# EAGLE design Adafruit 96x64 RGB OLED Breakout (EAGLE 9.6.2)
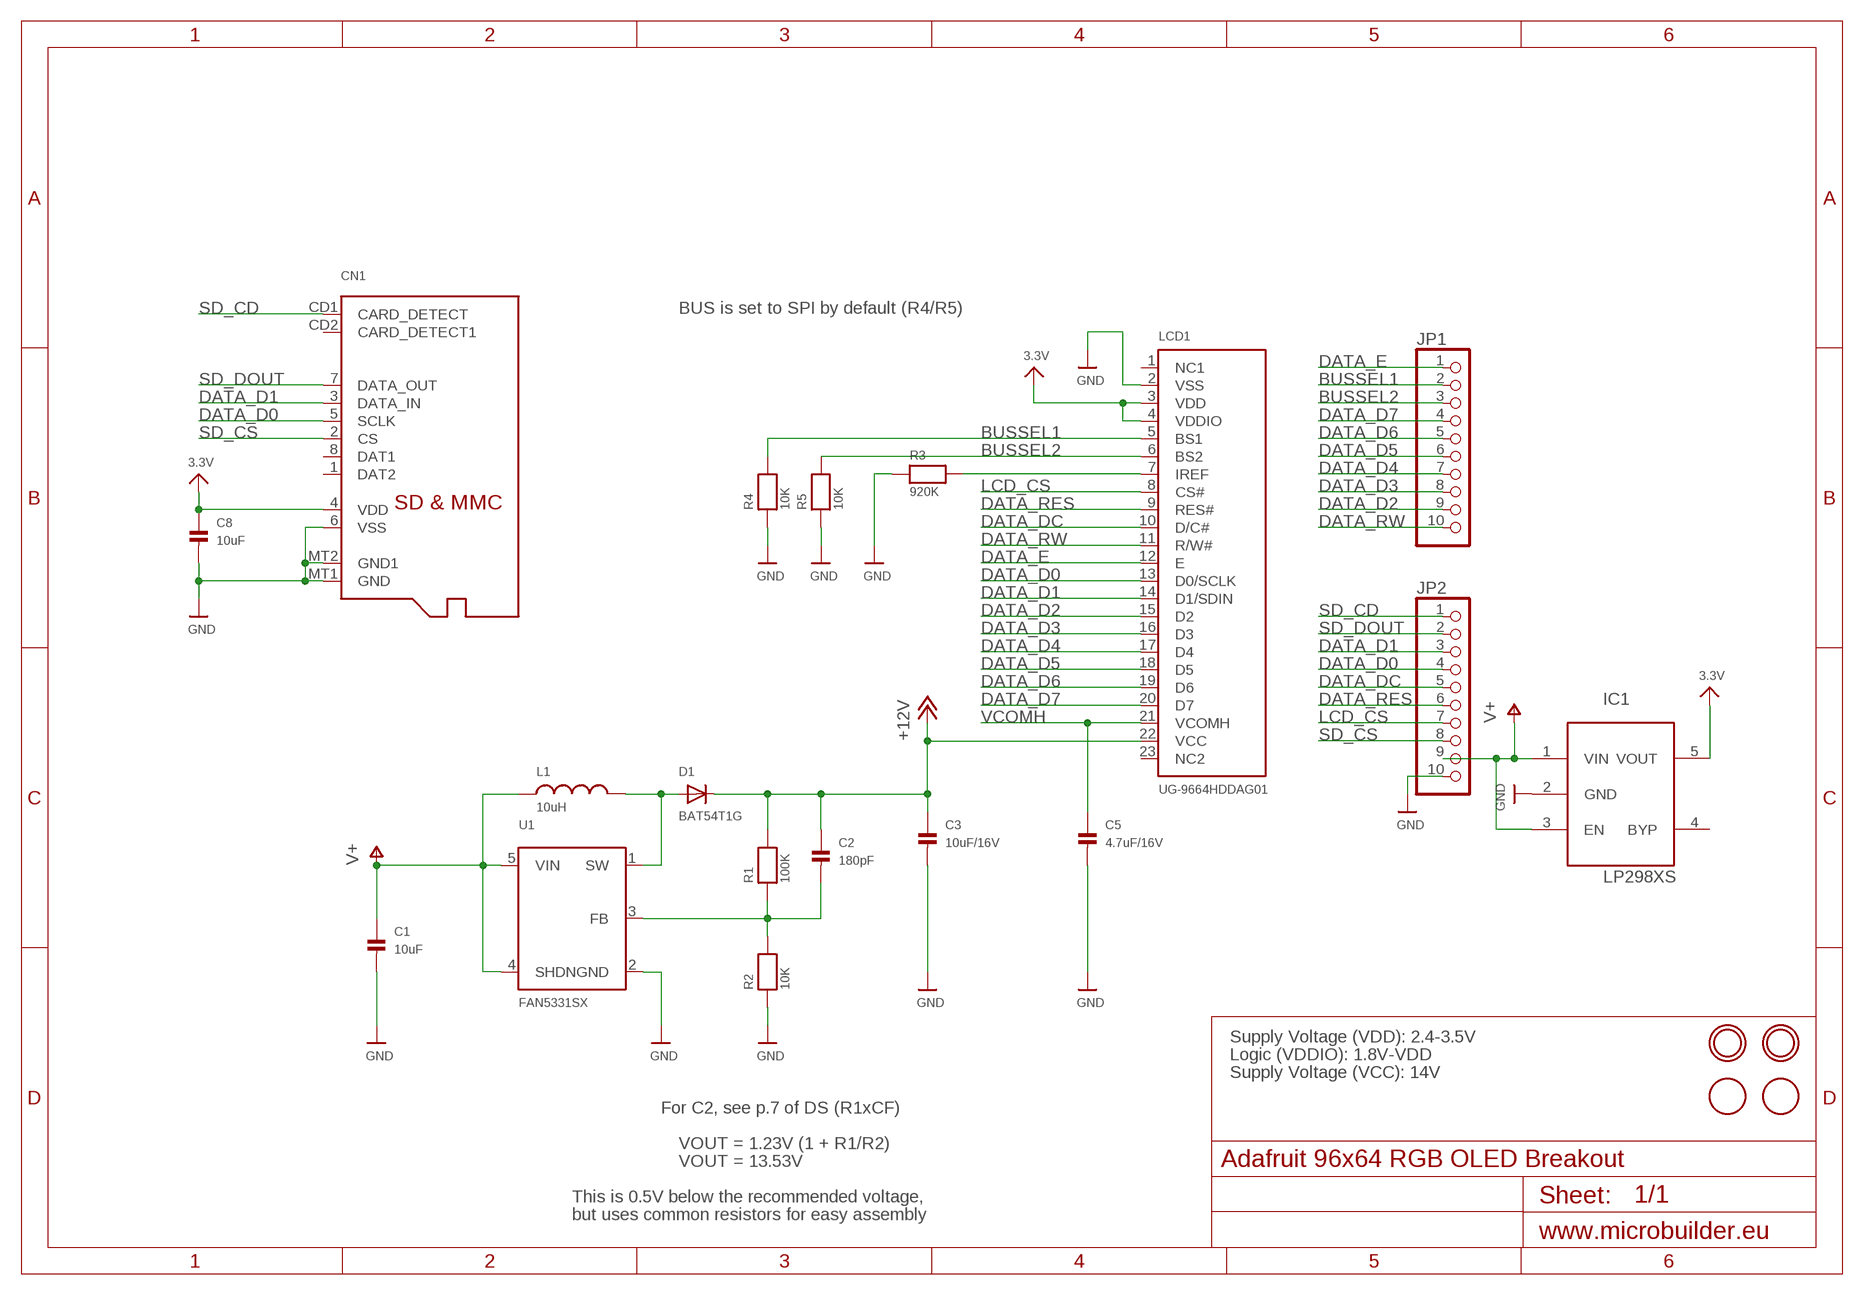
[diagram p0: schematic, sheet 1]

## Parts
C1  10uF  CAP_CERAMIC0805  [0805]
C2  180pF  CAP_CERAMIC0805  [0805]
C3  10uF/16V  CAP_CERAMIC0805  [0805]
C5  4.7uF/16V  CAP_CERAMIC0805  [0805]
C8  10uF  CAP_CERAMIC0805  [0805]
CN1  MICROSD  [MICROSD]
D1  BAT54T1G  DIODESOD-123  [SOD-123]
IC1  LP298XS  [SOT23-5L]
JP1  HEADER-1X10THICKER  [1X10_ROUND_76]
JP2  HEADER-1X10THICKER  [1X10_ROUND_76]
L1  10uH  INDUCTOR  [INDUCTOR_1007]
LCD1  UG-9664HDDAG01  OLED_UG-9664HDDAG01WRAPAROUND  [UG-9664HDDAG01_WRAPAROUND]
R1  100K  RESISTOR0805  [0805]
R2  10K  RESISTOR0805  [0805]
R3  920K  RESISTOR0805  [0805]
R4  10K  RESISTOR0805  [0805]
R5  10K  RESISTOR0805  [0805]
U1  FAN5331SX  FAN5331  [SOT23-5]
U$9  MOUNTINGHOLE2.0  [MOUNTINGHOLE_2.0_PLATED]
U$11  MOUNTINGHOLE2.0  [MOUNTINGHOLE_2.0_PLATED]
U$12  FIDUCIAL  [FIDUCIAL_1MM]
U$13  FIDUCIAL  [FIDUCIAL_1MM]

## Nets
3.3V: C8.1 CN1.4(VDD) IC1.5(VOUT) LCD1.3(VDD) LCD1.4(VDDIO)
+12V: C2.1 C3.1 D1.C LCD1.22(VCC) R1.2
BUSSEL1: JP1.2 LCD1.5(BS1) R4.2
BUSSEL2: JP1.3 LCD1.6(BS2) R5.2
DATA_D0: CN1.5(SCLK) JP2.4 LCD1.13(D0/SCLK)
DATA_D1: CN1.3(DATA_IN) JP2.3 LCD1.14(D1/SDIN)
DATA_D2: JP1.9 LCD1.15(D2)
DATA_D3: JP1.8 LCD1.16(D3)
DATA_D4: JP1.7 LCD1.17(D4)
DATA_D5: JP1.6 LCD1.18(D5)
DATA_D6: JP1.5 LCD1.19(D6)
DATA_D7: JP1.4 LCD1.20(D7)
DATA_DC: JP2.5 LCD1.10(D/C#)
DATA_E: JP1.1 LCD1.12(E)
DATA_RES: JP2.6 LCD1.9(RES#)
DATA_RW: JP1.10 LCD1.11(R/W#)
GND: C1.2 C3.2 C5.2 C8.2 CN1.6(VSS) CN1.MT1(GND) CN1.MT2(GND1) IC1.2(GND) JP2.10 LCD1.2(VSS) R2.1 R3.1 R4.1 R5.1 U1.2(GND)
LCD_CS: JP2.7 LCD1.8(CS#)
N$1: D1.A L1.P$2 U1.1(SW)
N$3: C2.2 R1.1 R2.2 U1.3(FB)
N$5: LCD1.7(IREF) R3.2
SD_CD: CN1.CD1(CARD_DETECT) JP2.1
SD_CS: CN1.2(CS) JP2.8
SD_DOUT: CN1.7(DATA_OUT) JP2.2
V+: C1.1 IC1.1(VIN) IC1.3(EN) JP2.9 L1.P$1 U1.4(SHDN) U1.5(VIN)
VCOMH: C5.1 LCD1.21(VCOMH)
Unconnected: CN1.1(DAT2) CN1.8(DAT1) CN1.CD2(CARD_DETECT1) IC1.4(BYP) LCD1.1(NC1) LCD1.23(NC2)

## Notes on the sheet
- BUS is set to SPI by default (R4/R5)
- Supply Voltage (VDD): 2.4-3.5V
- Logic (VDDIO): 1.8V-VDD
- Supply Voltage (VCC): 14V
- For C2, see p.7 of DS (R1xCF)
- VOUT = 1.23V (1 + R1/R2)
- VOUT = 13.53V
- This is 0.5V below the recommended voltage,
- but uses common resistors for easy assembly

## Library data of the parts
C1-C3 C5 C8 = microbuilder:CAP_CERAMIC: Ceramic Capacitors 0402 - 0402 Surface Mount Capacitors 16pF 50V 5% [Digikey: 445-4899-2-ND] 18pF 50V 5% [Digikey: 490-1281-2-ND] 22pF 50V 5% [Digikey: 490-1283-2-ND] 68pF 50V 5% [Digikey: 490-1289-2-ND] 0.1uF 10V 10% [Digikey: 490-1318-2-ND] 1.0uF 6.3V 10% [Digikey: 490-1320-2-ND] 0603 - 0603 Surface Mount Capacitors 16 pF 50V 5% [Digikey: 445-5051-2-ND] 22 pF 50V [Digikey: PCC220ACVTR-ND] 33 pF 50V 5% [Digikey: 490-1415-1-ND] 56pF 50V 5% [Digikey: 490-1421-1-ND] 220pF 50V 5% [Digikey: 445-1285-1-ND] 680 pF 50V 2200 pF 50V 5% C0G [Digikey: 445-1297-1-ND] 5600 pF 100V 5% X7R [Digikey: 478-3711-1-ND] 0.1 µF 25V 10% [Digikey: PCC2277TR-ND] 0.22 µF 16V 10% X7R [Digikey: 445-1318-1-ND] 1.0 µF 25V 10% [Digikey: 445-5146-2-ND] 0603 - RF Specific 3pF 250V +/-0.1pF RF [Digikey: 712-1347-1-ND] 18 pF 250V 5% [Digikey: 478-3505-1-ND or 712-1322-1-ND] 56 pF 250V 5% C0G RF [Digikey: 490-4867-1-ND] 68 pF 250V RF [Digikey: 490-4868-1-ND] 0805 - 0805 Surface Mount Capacitors 220 pF 250V 2% RF Ceramic Capacitor [Digikey: 712-1398-1-ND] 1000 pF 50V 2% NP0 Ceramic Capacitor [Digikey: 478-3760-1-ND] 0.1 µF 25V 10% Ceramic Capacitor [Digikey: PCC1828TR-ND] 1.0 µF 16V 10% Ceramic Capacitor[Digikey: 490-1691-2-ND] 10.0 µF 10V 10% Ceramic Capacitor[Digikey: 709-1228-1-ND] 10.0 uF 16V 10% Ceramic Capacitor [Digikey: 478-5165-2-ND] 47 uF 6.3V 20% Ceramic Capacitor [Digikey: 587-1779-1-ND or 399-5506-1-ND] 1206 - 1206 Surface Mount Capacitors 47uF 10V 20% Ceramic Capacitor [Digikey: 490-5528-1-ND or 399-5508-1-ND or 445-6010-1-ND] 100uF 6.3V -20%, +80% Y5V Ceramic Capacitor (Digikey: 490-4512-1-ND, Mouser: 81-GRM31CF50J107ZE1L)
CN1 = microbuilder:MICROSD: MicroSD/Transflash Card Holder with SPI pinout 3M: 2908-05WB-M6 4UConnector: 19656 Footprint courtesy: Adafruit Industries
D1 = microbuilder:DIODE: Diode SMA Model Volts Amps Type Vf Vr Digikey # Notes SSA34-E3 40V 3A Schottky 480mV @ 3A 200uA @ 40V SSA34-E3/61TGITR-ND CDBA120-G 20V 1A Schottky 500mV @ 1A 500uA @ 20V 641-1014-6-ND REEL MBRA210 10V 2A Schottky 350mV @ 2A 700uA @ 10V MBRA210LT3 SOD-123 Model Volts Amps Type Vf Vr Order # Notes BAT54T1G 30V 200mA Schottky 800mV @ 200mA 2uA @ 25V BAT54T1GOSTR-ND B0530W 30V 500mA Schottky 430mV @ 500mA 130uA @ 30V B0530W-FDICT-ND REEL MBR120 1A 20V Schottky 340mV @ 1A MBR120VLSFT1GOSCT-ND SOD-323 Model Volts Amps Type Vf Vr Order # Notes ZLLS410 10V 570mA Schottky 380mV @ 570mA ZLLS410CT-ND 1N4148WS 75V 150mA Silicon/Simple 1V 1N4148WSFSCT-ND REEL SOD-523 Model Volts Amps Type Vf Vr Order # Notes BAT54XV2 30V 200mA Schottky 0.8V @ 100mA BAT54XV2CT-ND TB751S 30V 30mA Schottky RB751S-40TE61CT-ND SOT23-R/W (R = Solder Paste/Reflow Ovens, W = Hand-Soldering) Model Volts Amps Type Vf Vr Order # Notes BAT54FILM 40V 300mA Schottky 497-7162-1-ND
IC1 = adafruit:LP298X
JP1 JP2 = microbuilder:HEADER-1X10: PIN HEADER
L1 = microbuilder:INDUCTOR: Inductors 0603: 10nH Ceramic Inductor - microwire antenna/RF (Digikey: 712-1434-2-ND) 0805: 560nH Ceramic Inductor - RF (Digikey: 553-1047-1-ND) 1007 (2518 Metric) SMT: 10µH 10% 250mOhm 820mA 1007 Inductor (Digikey: 587-2189-1-ND) 22µH 10% 500mOhm 580mA 1007 Inductor (Digikey: 587-2190-1-ND) 47µH 10% 950mOhm 420mA 1007 Inductor (Digikey: 587-2191-1-ND) 47µH 5% 100mOhm 1A 1008 Inductor (Digikey: 732-1816-1-ND) 5.0x5.0mm (TDK VLC5045 Series) 4.7µH 20% 3.3A 34mOhm Inductor (Digikey: 445-6526-1-ND) 6.8µH 20% 2.7A 46mOhm Inductor (Digikey: 445-6527-1-ND) 6.0x6.0mm (TDK VLC6045 Series) 4.7µH 20% 3.8A 27mOhm Inductor (Digikey: 445-6538-2-ND) 6.8µH 20% 3A 41mOhm Inductor (Digikey: 445-6540-1-ND) 6.2µH 30% 2.2A 45mOhm Inductor (Digikey: SRR5028-6R2YCT-ND) (Mouser: 652-SRR5028-6R2Y)- Not TDK VLC6045 but footprint should match 6.0x6.0mm (TDK SLF6045 Series) 6.8uH 30% 2A 33mOhm Inductor (Digikey: 445-4572-1-ND, Mouser: 810-SLF645T6R8N2R0PF)
LCD1 = microbuilder:OLED_UG-9664HDDAG01: OLED 96x64 Pixel, 0.95" 65K Color
R1-R5 = microbuilder:RESISTOR: Resistors 0402 - 0402 Surface Mount Package 22 Ohm 1% 1/16W [Digikey: 311-22.0LRTR-ND] 33 Ohm 5% 1/16W 1.0K 5% 1/16W 1.5K 5% 1/16W 2.0K 1% 1/16W 10.0K 1% 1/16W [Digikey: 311-10.0KLRTR-ND] 10.0K 5% 1/16W [Digikey: RMCF0402JT10K0TR-ND] 12.1K 1% 1/16W [Digikey: 311-22.0LRTR-ND] 100.0K 5% 1/16W 0603 - 0603 Surface Mount Package 0 Ohm 1/10 Watt 1% Resistor 15 Ohm 1/10 Watt 1% Resistor 33 Ohm 1/10 Watt 1% Resistor 49.9 Ohm 1/10 Watt 1% Resistor 100 Ohm 1/10 Watt 1% Resistor 150 Ohm 1/10 Watt 1% Resistor 240 Ohm 1/10 Watt 1% Resistor 390 Ohm 1/10 Watt 1% Resistor 560 Ohm 1/10 Watt 1% Resistor 680 Ohm 1/10 Watt 1% Resistor 750 Ohm 1/10 Watt 1% Resistor 1.0K Ohm 1/10 Watt 1% Resistor 1.5K Ohm 1/10 Watt 1% Resistor 2.0K Ohm 1/10 Watt 1% Resistor 2.2K Ohm 1/10 Watt 1% Resistor 3.3K Ohm 1/10 Watt 1% Resistor 4.7K Ohm 1/10 Watt 1% Resistor 10.0K Ohm 1/10 Watt 1% Resistor 12.0K Ohm 1/10 Watt 1% Resistor 12.1K Ohm 1/10 Watt 1% Resistor 20.0K Ohm 1/10 Watt 1% Resistor 33.0K Ohm 1/10 Watt 1% Resistor 100.0K Ohm 1/10 Watt 1% Resistor 0805 - 0805 Surface Mount Package 0 Ohm 1/8 Watt 1% Resistor 33 Ohm 1/8 Watt 1% Resistor 100 Ohm 1/8 Watt 1% Resistor 150 Ohm 1/8 Watt 1% Resistor 200 Ohm 1/8 Watt 1% Resistor 240 Ohm 1/8 Watt 1% Resistor 330 Ohm 1/8 Watt 1% Resistor 390 Ohm 1/8 Watt 1% Resistor 470 Ohm 1/8 Watt 1% Resistor 1.0K Ohm 1/8 Watt 1% Resistor 1.5K Ohm 1/8 Watt 1% Resistor 2.0K Ohm 1/8 Watt 1% Resistor 4.7K Ohm 1/8 Watt 1% Resistor 5.1K Ohm 1/8 Watt 1% Resistor 5.6K Ohm 1/8 Watt 1% Resistor 10.0K Ohm 1/8 Watt 1% Resistor 22.0K Ohm 1/8 Watt 1% Resistor 33.0K Ohm 1/8 Watt 1% Resistor 100K Ohm 1/8 Watt 1% Resistor 1206 - 1206 Surface Mount Package 2012 - 2010 Surface Mount Package 0.11 Ohm 1/2 Watt 1% Resistor - Digikey: RHM.11UCT-ND
U1 = microbuilder:FAN5331: FAN5331 - LED/OLED 20V Boost Converter Digikey: FAN5331SXCT-ND
U$9 U$11 = microbuilder:MOUNTINGHOLE: Mounting Hole
U$12 U$13 = adafruit:FIDUCIAL: For use by pick and place machines to calibrate the vision/machine, 1mm By microbuilder.eu

## Board
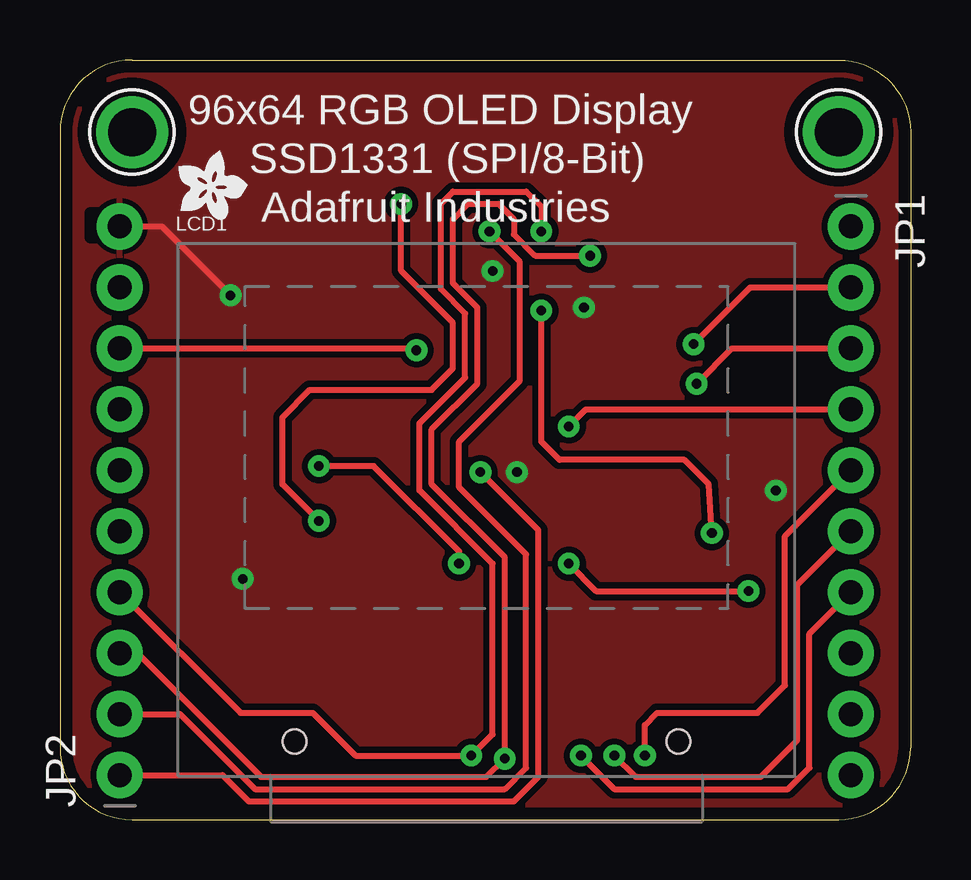
[diagram p1: board, top side]
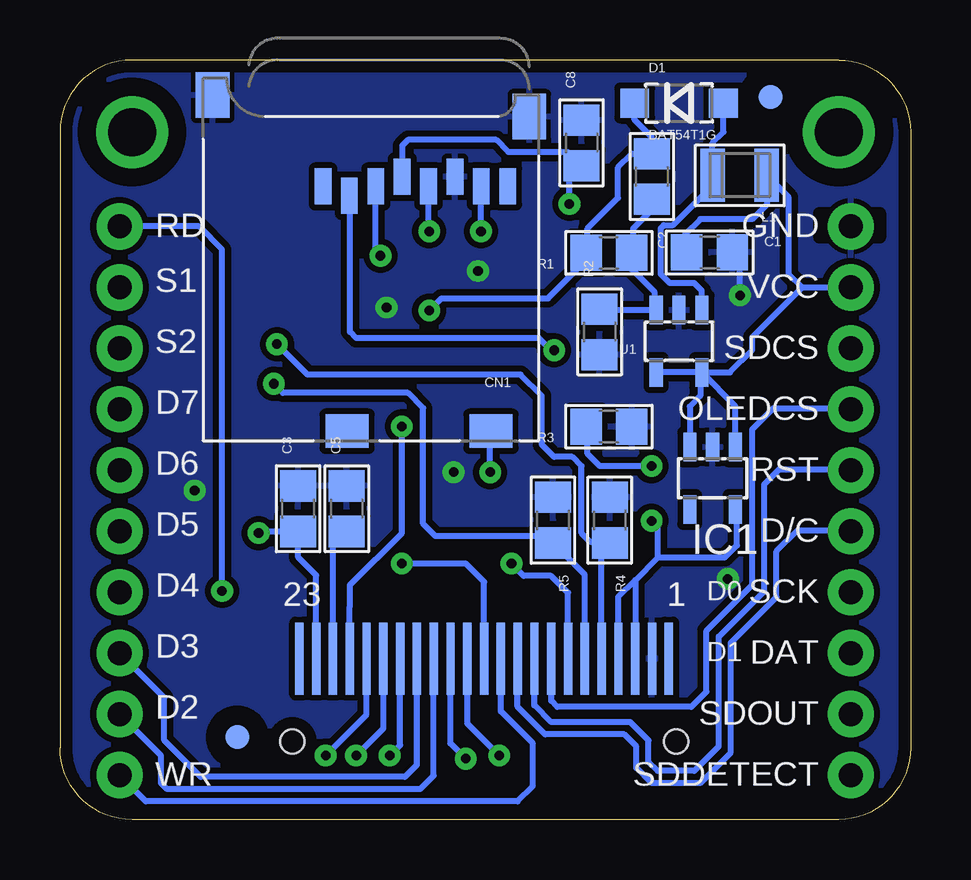
[diagram p2: board, bottom side, seen from below]

Size 35.46 x 31.65 mm. Coordinates in mm from the lower left corner, seen from the top.
Outline: 0,28.65 0,3 arc90 3,0 32.46,0 arc90 35.46,3 35.46,28.65 arc90 32.46,31.65 3,31.65 arc90 0,28.65
Copper layers (1*16): Top 0.035mm / dielectric 1.5mm / Bottom 0.035mm
Design rules "pcbcart *": minimum track width 8mil, minimum drill 0.4mm, track to track 10mil, track to pad 10mil, pad to pad 10mil, via to via 10mil, smd to smd 8mil, copper to edge 20mil, drill to drill 8mil, minimum pad ring 8mil, minimum via ring 10mil, stop-mask expansion 3mil, vias tented up to drill 25mil, thermal gap 8mil
tRestrict: area 1.3,24.3 to 1.5,25.3
bRestrict: area 1.3,24.3 to 1.5,25.3; area 3.6,24.3 to 3.8,25.3

### Footprints (pad centres in the part's own frame; a part is rotated, then mirrored left to right if it is on the bottom)
0805 = smd 1.3 x 1.5: 1 -0.95,0; 2 0.95,0
MICROSD = smd 0.7 x 1.5: 1 9,-10.64; 2 7.9,-10.24; 3 6.8,-10.64; 4 5.7,-11.04; 5 4.6,-10.64; 6 3.5,-11.04; 7 2.4,-10.64; 8 1.3,-10.64 | smd 1.8 x 1.4: CD1 2,-0.44; CD2 8,-0.44 | smd 1.4 x 1.9: MT1 0.4,-13.54; MT2 13.6,-14.44
SOD-123 = smd 1.2 x 1.2: A 1.85,0; C -1.85,0
SOT23-5L = smd 0.55 x 1.2: 1 -0.95,-1.3; 2 0,-1.3; 3 0.95,-1.3; 4 0.95,1.3; 5 -0.95,1.3
1X10_ROUND_76 = drill 1 pad 1.93: 1 -11.43,0; 2 -8.89,0; 3 -6.35,0; 4 -3.81,0; 5 -1.27,0; 6 1.27,0; 7 3.81,0; 8 6.35,0; 9 8.89,0; 10 11.43,0
INDUCTOR_1007 = smd 1.016 x 2.2: P$1 -1.127,0; P$2 1.127,0
UG-9664HDDAG01_WRAPAROUND = smd 0.35 x 3 bottom: 1 -7.7,4.9; 2 -7,4.9; 3 -6.3,4.9; 4 -5.6,4.9; 5 -4.9,4.9; 6 -4.2,4.9; 7 -3.5,4.9; 8 -2.8,4.9; 9 -2.1,4.9; 10 -1.4,4.9; 11 -0.7,4.9; 12 0,4.9; 13 0.7,4.9; 14 1.4,4.9; 15 2.1,4.9; 16 2.8,4.9; 17 3.5,4.9; 18 4.2,4.9; 19 4.9,4.9; 20 5.6,4.9; 21 6.3,4.9; 22 7,4.9; 23 7.7,4.9 | hole 1: -8,1.45; 8,1.45
SOT23-5 = smd 0.55 x 1.2: 1 -0.95,-1.3; 2 0,-1.3; 3 0.95,-1.3; 4 0.95,1.3; 5 -0.95,1.3
MOUNTINGHOLE_2.0_PLATED = drill 2 pad 3: P$1 0,0
FIDUCIAL_1MM = smd 1 x 1: 1 0,0

### Placement (x,y rotation side)
C1  8.38,23.63 0 bottom
C2  10.79,26.8 270 bottom
C3  25.54,12.95 90 bottom
C5  23.5,12.95 90 bottom
C8  13.72,28.19 90 bottom
CN1  15.49,15.75 180 bottom
D1  9.65,29.85 0 bottom
IC1  8.26,14.22 180 bottom
JP1  32.97,13.29 270 top
JP2  2.49,13.29 90 top
L1  7.12,26.84 180 bottom
LCD1  17.78,1.81 0 top
R1  12.57,23.61 180 bottom
R2  12.96,20.32 90 bottom
R3  12.57,16.37 180 bottom
R4  12.54,12.48 270 bottom
R5  14.91,12.48 270 bottom
U1  9.65,19.93 180 bottom
U$9  32.46,28.65 0 top
U$11  3,28.65 0 top
U$12  28.07,3.44 0 bottom
U$13  5.84,30.11 0 bottom
U$22  [ADAFRUIT200MIL]  6.35,26.54 270 top

### Tracks (layer width: path | path; a pad name or v marks a point on that pad's centre or on a via)
3.3V  (via drill 0.4)
  Top 0.254: v10.79,12.45 9.27,13.97 9.27,16.76 10.41,17.91 15.49,17.91 16.38,18.8 16.38,20.7 14.22,22.86 v14.22,25.65
  Bottom 0.254: CN1.4 21.19,28.08 20.96,28.32 17.27,28.32 16.76,27.81 14.29,27.81 C8.1 14.22,26.74 v14.22,25.65 | 11.48,9.98 LCD1.3 | 10.54,10.92 7.75,10.92 7.24,11.43 7.24,12.86 IC1.5 | LCD1.4 12.18,9.28 11.48,9.98 | 10.54,10.92 10.54,12.19 v10.79,12.45 | 11.48,9.98 10.54,10.92
+12V  (via drill 0.4)
  Top 0.254: v20.07,21.21 20.07,15.75 20.83,14.99 26.04,14.99 27.05,13.97 v27.18,11.94
  Bottom 0.254: D1.C 11.5,29.16 10.79,28.45 C2.1 11.62,27.75 12.19,27.18 12.19,25.91 13.46,24.64 13.46,23.67 R1.2 13.52,23.31 15.11,21.72 19.56,21.72 v20.07,21.21 | LCD1.22 24.78,10.18 25.53,10.92 25.53,11.99 C3.1 27.11,12 v27.18,11.94
BUSSEL1  (via drill 0.4)
  Top 0.254: JP1.2 28.78,22.18 v26.42,19.81
  Bottom 0.254: LCD1.5 12.88,11.19 R4.2 | R4.2 12.7,11.68 | v26.42,19.81 25.15,18.54 16.26,18.54 15.37,17.65 15.37,15.62 14.86,15.11 14.1,15.11 13.72,14.73 13.72,11.94 13.34,11.56 12.57,11.56 R4.2
BUSSEL2  (via drill 0.4)
  Top 0.254: JP1.3 28.02,19.64 v26.54,18.16
  Bottom 0.254: LCD1.6 13.58,10.2 R5.2 | R5.2 15.19,11.56 | v26.54,18.16 26.16,17.78 20.96,17.78 20.32,17.14 20.32,12.32 19.81,11.81 15.19,11.81 R5.2
DATA_D0  (via drill 0.4)
  Top 0.254: JP2.4 7.52,4.45 10.54,4.45 12.32,2.67 v17.14,2.67 18.03,3.56 18.03,10.67 14.99,13.72 14.99,16.51 16.89,18.41 16.89,21.08 15.88,22.1 15.88,25.65 16.38,26.16 19.43,26.16 20.07,25.53 v20.07,24.51
  Bottom 0.254: LCD1.13 18.48,4 v17.14,2.67 | CN1.5 20.09,24.54 v20.07,24.51
DATA_D1  (via drill 0.4)
  Top 0.254: JP2.3 2.54,6.99 3.18,6.99 8.38,1.78 17.78,1.78 v18.54,2.54 18.54,10.92 15.49,13.97 15.49,16.26 17.4,18.16 17.4,21.34 16.38,22.35 16.38,25.02 17.02,25.65 18.29,25.65 18.92,25.02 18.92,24.38 19.81,23.5 v22.1,23.5
  Bottom 0.254: LCD1.14 19.18,3.18 v18.54,2.54 | CN1.3 22.29,23.69 v22.1,23.5
DATA_D2
  Bottom 0.254: LCD1.15 19.88,1.84 20.45,1.27 30.99,1.27 31.24,1.52 31.24,2.67 JP1.9
DATA_D3
  Bottom 0.254: LCD1.16 20.58,2.28 21.08,1.78 29.59,1.78 31.11,3.3 31.11,5.08 JP1.8
DATA_D4  (via drill 0.4)
  Top 0.254: v21.72,2.67 23.11,1.27 30.35,1.27 31.24,2.16 31.24,7.75 JP1.7
  Bottom 0.254: LCD1.17 21.28,3.1 v21.72,2.67
DATA_D5  (via drill 0.4)
  Top 0.254: v23.11,2.67 24,1.78 29.21,1.78 30.73,3.3 30.73,9.78 JP1.6
  Bottom 0.254: LCD1.18 21.98,3.8 v23.11,2.67
DATA_D6  (via drill 0.4)
  Top 0.254: v24.38,2.67 24.38,3.94 24.89,4.45 29.08,4.45 30.23,5.59 30.23,11.81 JP1.5
  Bottom 0.254: LCD1.19 22.68,4.37 v24.38,2.67
DATA_D7  (via drill 0.4)
  Top 0.254: 32.92,17.14 JP1.4 21.92,17.09 v21.21,16.38
  Bottom 0.254: LCD1.20 23.38,8.88 23.37,8.89 23.37,9.78 21.21,11.94 v21.21,16.38
DATA_DC
  Bottom 0.254: LCD1.10 16.38,4.7 15.24,3.56 11.94,3.56 11.43,3.05 11.43,2.16 10.79,1.52 8.76,1.52 7.49,2.79 7.49,7.37 5.59,9.27 5.59,11.18 4.7,12.06 2.54,12.06 JP2.5
DATA_E  (via drill 0.4)
  Top 0.254: v28.7,9.53 22.35,9.53 v21.21,10.67
  Bottom 0.254: JP1.1 29.67,24.71 28.7,23.75 v28.7,9.53 | v21.21,10.67 18.54,10.67 17.78,9.91 LCD1.12
DATA_RES
  Bottom 0.254: LCD1.9 15.68,4.76 14.99,4.06 11.68,4.06 10.92,3.3 10.92,2.41 10.54,2.03 9.02,2.03 8,3.05 8,7.62 6.1,9.53 6.1,13.97 5.46,14.61 2.54,14.61 JP2.6
DATA_RW
  Bottom 0.254: JP1.10 31.88,0.76 16.38,0.76 15.75,1.4 15.75,3.17 17.08,4.51 LCD1.11
GND  (via drill 0.4)
  Top 0.254: JP2.10 4.24,24.71 v7.11,21.84
  Bottom 0.254: v7.11,21.84 7.11,23.31 C1.2
  other vias: 19.05,14.48 7.62,10.03 18.03,22.86 21.84,21.34 29.84,13.72
  pour Bottom (isolate 0.254): 0,31.65 35.46,31.65 35.46,0 0,0
  pour Top (isolate 0.254): -1.27,31.65 36.73,31.65 36.73,0 -1.27,0
LCD_CS
  Bottom 0.254: LCD1.8 14.98,4.95 14.73,4.7 9.14,4.7 8.51,5.33 8.51,7.87 6.6,9.78 6.6,16.26 5.71,17.14 2.54,17.14 JP2.7
N$1
  Bottom 0.254: D1.A 7.8,28.65 8.26,28.19 L1.P$2 8.38,26.71 8.38,26.29 9.91,24.77 10.29,24.77 10.41,24.64 10.41,22.73 10.03,22.35 9.02,22.35 8.7,22.04 U1.1
N$3
  Bottom 0.254: C2.2 10.79,25.41 11.56,24.64 11.56,23.68 R1.1 11.62,22.93 10.67,21.97 10.67,21.3 U1.3 12.92,21.23 R2.2
N$5  (via drill 0.4)
  Top 0.254: v10.79,14.73 13.08,14.73 16.64,11.18 v16.64,10.67
  Bottom 0.254: LCD1.7 14.28,9.45 14.99,10.16 16.13,10.16 v16.64,10.67 | v10.79,14.73 12.95,14.73 13.46,15.24 13.46,16.31 R3.2
SD_CD  (via drill 0.4)
  Top 0.254: JP2.1 6.78,1.85 7.87,0.76 18.92,0.76 19.94,1.78 19.94,12.06 v17.53,14.48
  Bottom 0.254: v17.53,14.48 17.53,16.16 CN1.CD1
SD_CS  (via drill 0.4)
  Top 0.254: JP2.8 14.78,19.64 v14.86,19.56
  Bottom 0.254: CN1.2 23.37,25.96 23.37,20.32 23.11,20.07 15.49,20.07 14.99,19.56 v14.86,19.56
SD_DOUT  (via drill 0.4)
  Top 0.254: JP2.2 5,4.39 8.13,1.27 18.54,1.27 19.43,2.16 19.43,11.05 16.64,13.84 16.64,15.75 19.18,18.29 19.18,23.24 v17.91,24.51
  Bottom 0.254: v17.91,24.51 17.91,26.38 CN1.7
V+
  Bottom 0.254: U1.5 U1.4 | C1.1 9.4,23.7 9.4,24.38 8.76,25.02 6.6,25.02 6,25.63 L1.P$1 5.08,25.93 5.08,22.73 4.52,22.18 | 4.52,22.18 JP2.9 | U1.5 7.53,18.63 6.6,19.56 6.6,20.09 4.52,22.18 | IC1.1 7.3,17.23 U1.5 | IC1.3 9.21,17.21 8.76,17.65 8.76,18.57 U1.5
VCOMH
  Bottom 0.254: LCD1.21 24.08,11.43 C5.1

### Text on the board
tPlace: 96x64 RGB OLED Display | SSD1331 (SPI/8-Bit) | Adafruit Industries
bPlace: GND | RD | VCC | S1 | SDCS | S2 | OLEDCS | D7 | RST | D6 | D/C | D5 | SCK | D0 | 1 | 23 | D4 | DAT | D1 | D3 | SDOUT | D2 | SDDETECT | WR